# EAGLE design mapleCUx_large_4.1-018-not-produced (EAGLE 9.1.1)
MAPLE-CUx Large Version
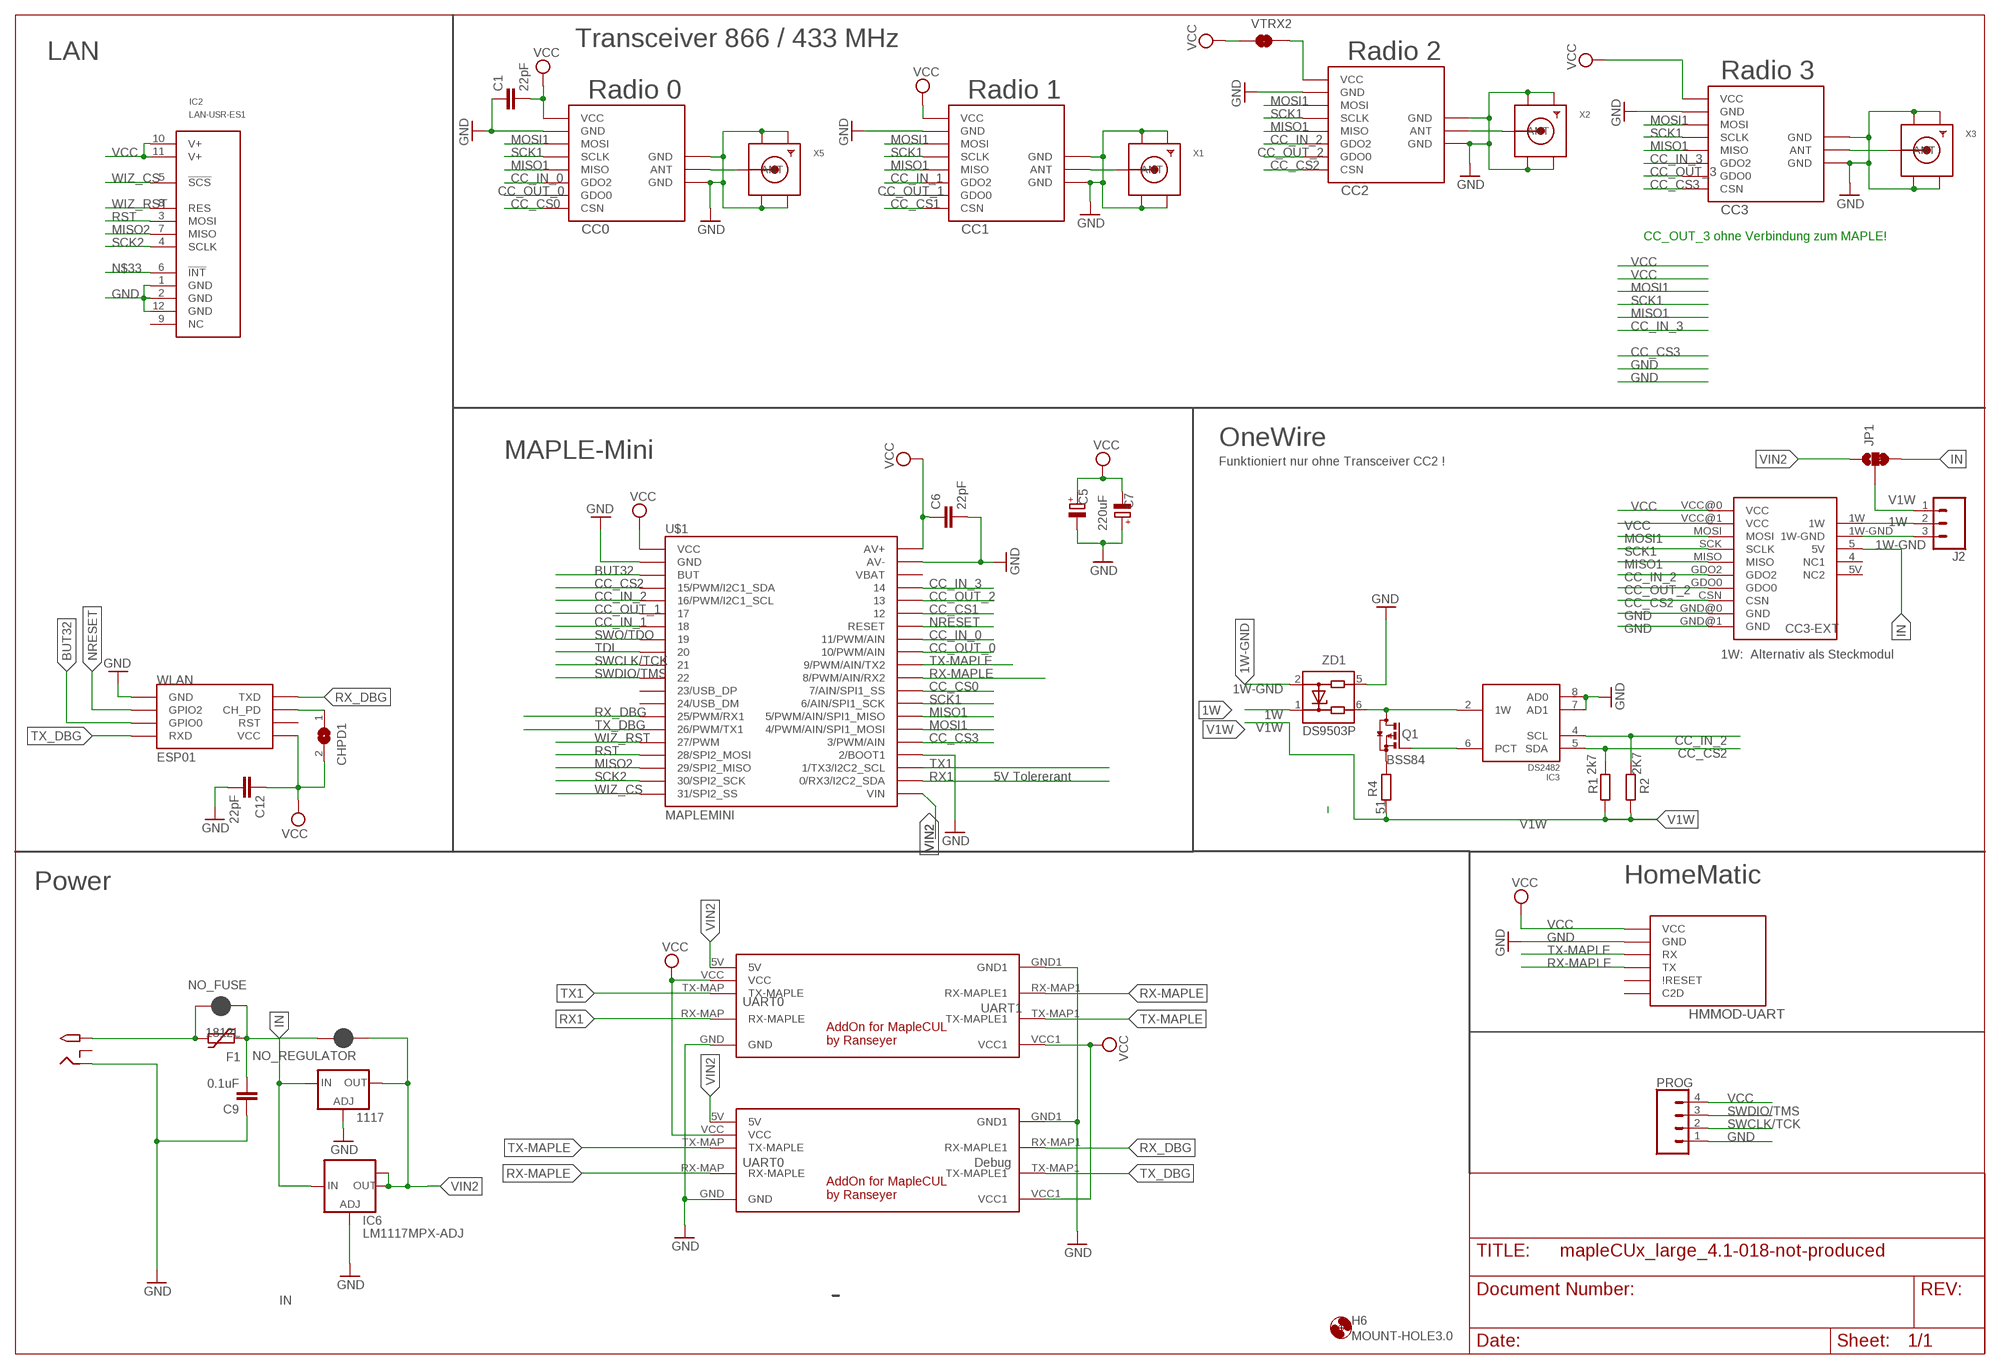
[diagram p0: schematic, sheet 1]

## Parts
1117  LD117ADT50TR  [DPACK]
C1  22pF  C-EUC0805  [C0805]
C5  220uF  CPOL-EUE5-8.5  [E5-8,5]
C6  22pF  C-EUC0805  [C0805]
C7  CPOL-EUSMCE  [SMC_E]
C9  0.1uF  C-EUC1206  [C1206]
C12  22pF  C-EUC0805  [C0805]
CC0  CC1101  CC1101_MODULE1SMD  [CC1101_MODULE1_SMD]
CC1  CC1101_MODULE1SMD  [CC1101_MODULE1_SMD]
CC2  CC1101_MODULE1SMD  [CC1101_MODULE1_SMD]
CC3  CC1101_MODULE1SMD  [CC1101_MODULE1_SMD]
CC3-EXT  ONEWIRE-MODULE  [ONEWIRE_CC1101_MODULE3_DIL]
CHPD1  SJ  [SJ]
F1  1812L  [1812L]
H6  MOUNT-HOLE3.0  [3,0]
HMMOD-UART  HM-MOD-UARTDIL  [HM-MOD-UART-DIL]
IC2  LAN-USR-ES1  [USR-ES1]
IC3  DS2482  DS2482-100S  [SO08]
IC6  LM1117MPX-ADJ  [SOT223]
J2  CONN_03LONGPADS  [1X03_LONGPADS]
JP1  JUMPER-SMT_3_1-NC_TRACE_SILK  [SMT-JUMPER_3_1-NC_TRACE_SILK]
NO_FUSE  JUMPER-SMT_2_NC_PASTE_NO-SILK  [SMT-JUMPER_2_NC_PASTE_NO-SILK]
NO_REGULATOR  JUMPER-SMT_2_NC_PASTE_NO-SILK  [SMT-JUMPER_2_NC_PASTE_NO-SILK]
PROG  CONN_04LOCK  [1X04_LOCK]
Q1  BSS84  [SOT23]
R1  2k7  R-EU_R0805  [R0805]
R2  2K7  R-EU_R0805  [R0805]
R4  51  R-EU_R0805  [R0805]
U$1  MAPLEMINI  [20-DIP]
U$2  2.1MMJACKTHM  [PJ-102A]
U$3  MAPLE-CUL-ADDON-V01  [MAPLE-CUL-V01]
U$4  MAPLE-CUL-ADDON-V01  [MAPLE-CUL-V01]
VTRX2  JUMPER-SMT_2_NC_TRACE_SILK  [SMT-JUMPER_2_NC_TRACE_SILK]
WLAN  ESP01  [ESP01]
X1  SMACONNECTOR_EDGE  [SMA_EDGELAUNCH]
X2  SMACONNECTOR_EDGE  [SMA_EDGELAUNCH]
X3  SMACONNECTOR_EDGE  [SMA_EDGELAUNCH]
X5  SMACONNECTOR_EDGE  [SMA_EDGELAUNCH]
ZD1  DS9503P  [TSOC6]

## Nets
1W: CC3-EXT.1W J2.2 ZD1.1
1W-GND: CC3-EXT.1W-GND J2.3 ZD1.2
ANT0: CC0.ANT X5.P(ANT)
ANT1: CC1.ANT X1.P(ANT)
ANT2: CC2.ANT X2.P(ANT)
ANT3: CC3.ANT X3.P(ANT)
BUT32: U$1.3(BUT) WLAN.GPIO0
CC_CS0: CC0.CSN U$1.29(7/AIN/SPI1_SS)
CC_CS1: CC1.CSN U$1.35
CC_CS2: CC2.CSN CC3-EXT.CSN IC3.5(SDA) R1.2 U$1.4(15/PWM/I2C1_SDA)
CC_CS3: CC3.CSN U$1.25(3/PWM/AIN)
CC_IN_0: CC0.GDO2 U$1.33(11/PWM/AIN)
CC_IN_1: CC1.GDO2 U$1.7
CC_IN_2: CC2.GDO2 CC3-EXT.GDO2 IC3.4(SCL) R2.2 U$1.5(16/PWM/I2C1_SCL)
CC_IN_3: CC3.GDO2 U$1.37
CC_OUT_0: CC0.GDO0 U$1.32(10/PWM/AIN)
CC_OUT_1: CC1.GDO0 U$1.6
CC_OUT_2: CC2.GDO0 CC3-EXT.GDO0 U$1.36
CC_OUT_3: CC3.GDO0
GND [Power]: 1117.1(ADJ) C1.1 C5.- C6.2 C7.+ C9.1 C12.2 CC0.GND@0(GND) CC0.GND@1(GND) CC0.GND@2(GND) CC1.GND@0(GND) CC1.GND@1(GND) CC1.GND@2(GND) CC2.GND@0(GND) CC2.GND@1(GND) CC2.GND@2(GND) CC3-EXT.GND@0(GND) CC3-EXT.GND@1(GND) CC3.GND@0(GND) CC3.GND@1(GND) CC3.GND@2(GND) HMMOD-UART.2(GND) IC2.1(GND) IC2.2(GND) IC2.12(GND) IC3.7(AD1) IC3.8(AD0) IC6.1(ADJ) PROG.1 U$1.2(GND) U$1.24(2/BOOT1) U$1.39(AV-) U$2.RING U$3.GND U$3.GND1 U$4.GND U$4.GND1 WLAN.GND X1.GND@1(GND4) X1.GND@2(GND3) X1.GND@3(GND2) X1.GND@4(GND1) X2.GND@1(GND4) X2.GND@2(GND3) X2.GND@3(GND2) X2.GND@4(GND1) X3.GND@1(GND4) X3.GND@2(GND3) X3.GND@3(GND2) X3.GND@4(GND1) X5.GND@1(GND4) X5.GND@2(GND3) X5.GND@3(GND2) X5.GND@4(GND1) ZD1.5
IN [Power]: 1117.3(IN) C9.2 CC3-EXT.5(5V) F1.P$1 IC6.3(IN) JP1.3 NO_FUSE.1 NO_REGULATOR.2
MISO1: CC0.MISO CC1.MISO CC2.MISO CC3-EXT.MISO CC3.MISO U$1.27(5/PWM/AIN/SPI1_MISO)
MISO2: IC2.7(MISO) U$1.18(29/SPI2_MISO)
MOSI1: CC0.MOSI CC1.MOSI CC2.MOSI CC3-EXT.MOSI CC3.MOSI U$1.26(4/PWM/AIN/SPI1_MOSI)
N$1 [Power]: CC2.VCC VTRX2.2
N$2: CHPD1.1 WLAN.CH_PD
N$33: IC2.6(!INT!)
N$47: IC3.6(PCT) Q1.1(G)
N$48: IC3.2(1W) Q1.3(D) ZD1.6
N$52: Q1.2(S) R4.1
NRESET: U$1.34(RESET) WLAN.GPIO2
RST: IC2.3(MOSI) U$1.17(28/SPI2_MOSI)
RX1: U$1.22(0/RX3/I2C2_SDA) U$3.RX-MAP(RX-MAPLE)
RX-MAPLE: HMMOD-UART.5(TX) U$1.30(8/PWM/AIN/RX2) U$3.RX-MAP1(RX-MAPLE1) U$4.RX-MAP(RX-MAPLE)
RX_DBG: U$1.14(25/PWM/RX1) U$4.RX-MAP1(RX-MAPLE1) WLAN.TX(TXD)
SCK1: CC0.SCLK CC1.SCLK CC2.SCLK CC3-EXT.SCK(SCLK) CC3.SCLK U$1.28(6/AIN/SPI1_SCK)
SCK2: IC2.4(SCLK) U$1.19(30/SPI2_SCK)
SWCLK/TCK: PROG.2 U$1.10
SWDIO/TMS: PROG.3 U$1.11
SWO/TDO: U$1.8
TDI: U$1.9
TX1: U$1.23(1/TX3/I2C2_SCL) U$3.TX-MAP(TX-MAPLE)
TX-MAPLE: HMMOD-UART.6(RX) U$1.31(9/PWM/AIN/TX2) U$3.TX-MAP1(TX-MAPLE1) U$4.TX-MAP(TX-MAPLE)
TX_DBG: U$1.15(26/PWM/TX1) U$4.TX-MAP1(TX-MAPLE1) WLAN.RX(RXD)
V1W [Power]: J2.1 JP1.2 R1.1 R2.1 R4.2
VCC [Power]: C1.2 C5.+ C6.1 C7.- C12.1 CC0.VCC CC1.VCC CC3-EXT.VCC@0(VCC) CC3-EXT.VCC@1(VCC) CC3.VCC CHPD1.2 HMMOD-UART.1(VCC) IC2.10(V+) IC2.11(V+) PROG.4 U$1.1(VCC) U$1.40(AV+) U$3.VCC U$3.VCC1 U$4.VCC U$4.VCC1 VTRX2.1 WLAN.VCC
VIN [Power]: F1.P$2 NO_FUSE.2 U$2.TIP
VIN2 [Power]: 1117.4(OUT) IC6.2(OUT) IC6.TAB(OUT1) JP1.1 NO_REGULATOR.1 U$1.21(VIN) U$3.5V U$4.5V
WIZ_CS: IC2.5(!SCS!) U$1.20(31/SPI2_SS)
WIZ_RST: IC2.8(RES) U$1.16(27/PWM)
Unconnected: CC3-EXT.4(NC1) CC3-EXT.5V(NC2) HMMOD-UART.3(C2D) HMMOD-UART.4(\!RESET) IC2.9(NC) U$1.12(23/USB_DP) U$1.13(24/USB_DM) U$1.38(VBAT) U$2.RING_SW WLAN.RST

## Notes on the sheet
- Transceiver 866 / 433 MHz
- LAN | Radio 2
- Radio 3
- Radio 0 | Radio 1
- CC_OUT_3 ohne Verbindung zum MAPLE!
- OneWire
- MAPLE-Mini
- Funktioniert nur ohne Transceiver CC2 !
- 1W:  Alternativ als Steckmodul
- 5V Tolererant
- Power | HomeMatic
- UART0
- UART1
- UART0 | Debug

## Power pins joined to a net without a drawn wire
GND: IC3.3(GND)
V1W: IC3.1(VDD)

## Library data of the parts
1117 = v-reg:LD117A?*: Low drop fixed and adjustable positive voltage regulators 1 A Source: http://www.st.com/stonline/products/literature/ds/7194/ld1117axx.pdf
C1 C6 C9 C12 = rcl:C-EU: CAPACITOR, European symbol
C5 = rcl:CPOL-EU: POLARIZED CAPACITOR, European symbol
C7 = rcl:CPOL-EU: POLARIZED CAPACITOR, European symbol; SPICEPREFIX: C
CC0 CC1-CC3 = wireless:CC1101_MODULE1: CC1101 wireless module for 433/868 MHz (sold from Aliexpress). DIL version for mounting with pin header (and SMD soldering) and SMD only variant available.
CC3-EXT = CC1101:ONEWIRE-MODULE
CHPD1 = jumper:SJ: SMD solder JUMPER
F1 = ptc-littlefuse:1812L
H6 = holes:MOUNT-HOLE: MOUNTING HOLE with drill center marker
HMMOD-UART = wireless:HM-MOD-UART: eQ3 HM-MOD-UART-AW-SH2 wireless module for 868 MHz. DIL version for mounting with pin header (antenna upwards) and SMD variant available (antenna downwards).
IC2 = Martin-Communication:LAN-USR-ES1
IC3 = 1wire:DS2482-100: I2C to 1-Wire Host Adapter/Line Driver This device is a onewire host and I2C interface in one chip. It provides the complete DC/AC requirements for onewire communication, including overdrive speed mode, but, unlike the DS2480B chip, no 12V EPROM programming. Notes: For overdrive speed and 5V EEPROM programming, an external active pullup circuit must be connected to the 1W, VDD and PCT pin. See the datasheet for details. The lower two I2C adress bits of the chip can be selected by external pins, so up to 4 chips may be connected to the same I2C bus. Author: Orginal device and description from Giovanni Varasano <giovanni.varasano@fastwebnet.it> Improved by Jan Kandziora <jjj@gmx.de>
IC6 = lm1117:LM1117MPX-ADJ
J2 = SparkFun-Connectors:CONN_03: Multi connection point. Often used as Generic Header-pin footprint for 0.1 inch spaced/style header connections On any of the 0.1 inch spaced packages, you can populate with these: Break Away Headers - Straight <https://www.sparkfun.com/products/116> (PRT-00116) Break Away Male Headers - Right Angle <https://www.sparkfun.com/products/553> (PRT-00553) Female Headers <https://www.sparkfun.com/products/115> (PRT-00115) Break Away Headers - Machine Pin <https://www.sparkfun.com/products/117> (PRT-00117) Break Away Female Headers - Swiss Machine Pin <https://www.sparkfun.com/products/743> (PRT-00743) Stackable Header - 3 Pin (Female, 0.1") <https://www.sparkfun.com/products/13875> (PRT-13875) For SCREWTERMINALS and SPRING TERMINALS visit here: Screw Terimnals on SparkFun.com <https://www.sparkfun.com/search/results?term=Screw+Terminals> (5mm/3.5mm/2.54mm spacing) This device is also useful as a general connection point to wire up your design to another part of your project. Our various solder wires solder well into these plated through hole pads. Hook-Up Wire - Assortment (Stranded, 22 AWG) <https://www.sparkfun.com/products/11375> (PRT-11375) Hook-Up Wire - Assortment (Solid Core, 22 AWG) <https://www.sparkfun.com/products/11367> (PRT-11367) View the entire wire category on our website here <https://www.sparkfun.com/categories/141> Special notes: Molex polarized connector foot print use with SKU : PRT-08232 with associated crimp pins and housings.
JP1 = SparkFun-Jumpers:JUMPER-SMT_3_1-NC_TRACE: Normally closed trace jumper (1 of 2 connections) This jumper has a trace between two pads so it's normally closed (NC). The other connection is normally open (NO). Use a razor knife to open the connection. For best results follow the IPC guidelines for cutting traces: Cutout at least 0.063 mm (0.005 in). Remove all loose material to clean up the cut area. Seal the cut with an approved epoxy. Reapply solder to reclose the connection, or to close the NO connection.
NO_FUSE NO_REGULATOR = SparkFun-Jumpers:JUMPER-SMT_2_NC_PASTE: Normally closed solder jumper This jumper has an aperture in the stencil to allow solder paste to bridge the split in the wire so it's normally closed (NC). Wick off the solder to open the connection. Reapply solder to reclose the connection.
PROG = SparkFun-Connectors:CONN_04: Multi connection point. Often used as Generic Header-pin footprint for 0.1 inch spaced/style header connections On any of the 0.1 inch spaced packages, you can populate with these: Break Away Headers - Straight <https://www.sparkfun.com/products/116> (PRT-00116) Break Away Male Headers - Right Angle <https://www.sparkfun.com/products/553> (PRT-00553) Female Headers <https://www.sparkfun.com/products/115> (PRT-00115) Break Away Headers - Machine Pin <https://www.sparkfun.com/products/117> (PRT-00117) Break Away Female Headers - Swiss Machine Pin <https://www.sparkfun.com/products/743> (PRT-00743) For SCREWTERMINALS and SPRING TERMINALS visit here: Screw Terimnals on SparkFun.com <https://www.sparkfun.com/search/results?term=Screw+Terminals> (5mm/3.5mm/2.54mm spacing) This device is also useful as a general connection point to wire up your design to another part of your project. Our various solder wires solder well into these plated through hole pads. Hook-Up Wire - Assortment (Stranded, 22 AWG) <https://www.sparkfun.com/products/11375> (PRT-11375) Hook-Up Wire - Assortment (Solid Core, 22 AWG) <https://www.sparkfun.com/products/11367> (PRT-11367) View the entire wire category on our website here <https://www.sparkfun.com/categories/141> Special notes: Molex polarized connector foot print use with SKU : PRT-08231 with associated crimp pins and housings. 1MM SMD Version SKU: PRT-10208; PROD_ID: CONN-09696
Q1 = transistor-small-signal:BSS84: P-CHANNEL MOS FET
R1 R2 R4 = rcl:R-EU_: RESISTOR, European symbol
U$1 = maplemini-small:MAPLEMINI
U$2 = adafruit:2.1MMJACK: 2.1mm x 5.5mm THM DC jack with internal switch. Digikey part #PJ-102A, 4UCON part #05537 2.1mm x 5.5mm SMT DC jack with internal switch. Digikey part #PJ-002A-SMT, 4UCON part #03267 By microbuilder.eu & adafruit.com
U$3 U$4 = Martin-Communication-V4:MAPLE-CUL-ADDON-V01: AddOn for MAPLE-CUL V4.x
VTRX2 = SparkFun-Jumpers:JUMPER-SMT_2_NC_TRACE: Normally closed trace jumper This jumper has a trace between two pads so it's normally closed (NC). Use a razor knife to open the connection. For best results follow the IPC guidelines for cutting traces: Cutout at least 0.063 mm (0.005 in). Remove all loose material to clean up the cut area. Seal the cut with an approved epoxy. Reapply solder to reclose the connection.
WLAN = esp8266modules:ESP01: ESP8266 Wifi module 01
X1-X3 X5 = adafruit:SMACONNECTOR: SMA Connector 90° DIP SMA Connector, 50 Ohm (4UConnector: 07259)
ZD1 = 1wire:DS9503: ESD Protection Diode with Resistors This ESD protection diode is designed especially for onewire host interfaces. Unlike the DS9502, it has two additional 5Ohm resitors in the 1W and GND line. Pin 5 and 6 have to be connected to the host side, pin 1 und 2 to the network side. The 1W line is through pin 1 and 6, the GND line is through pin 2 and 5. Author: Jan Kandziora <jjj@gmx.de>

## Net classes
0 default: width 0.305 mm
1 Power: width 0.61 mm

## Board
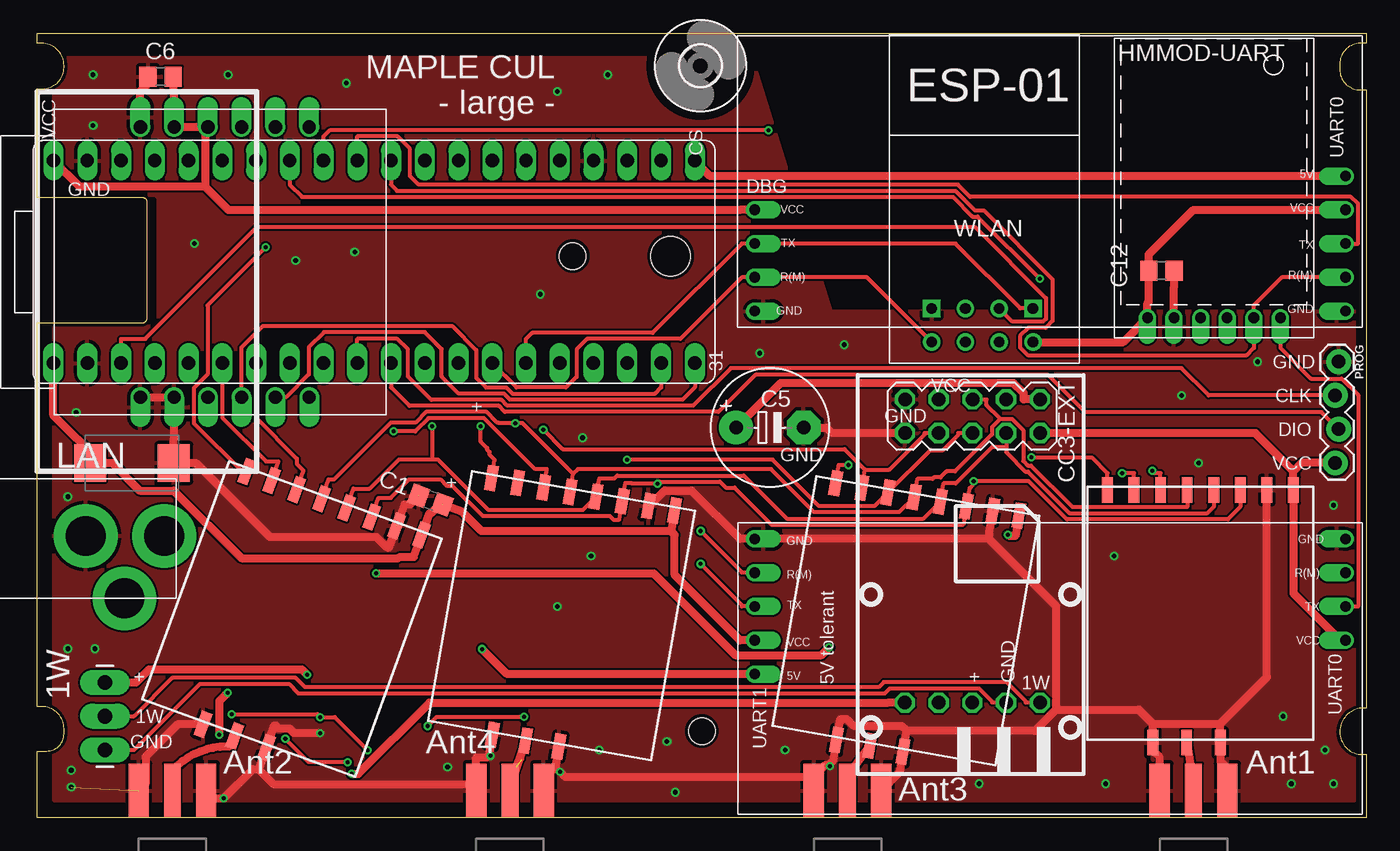
[diagram p1: board, top side]
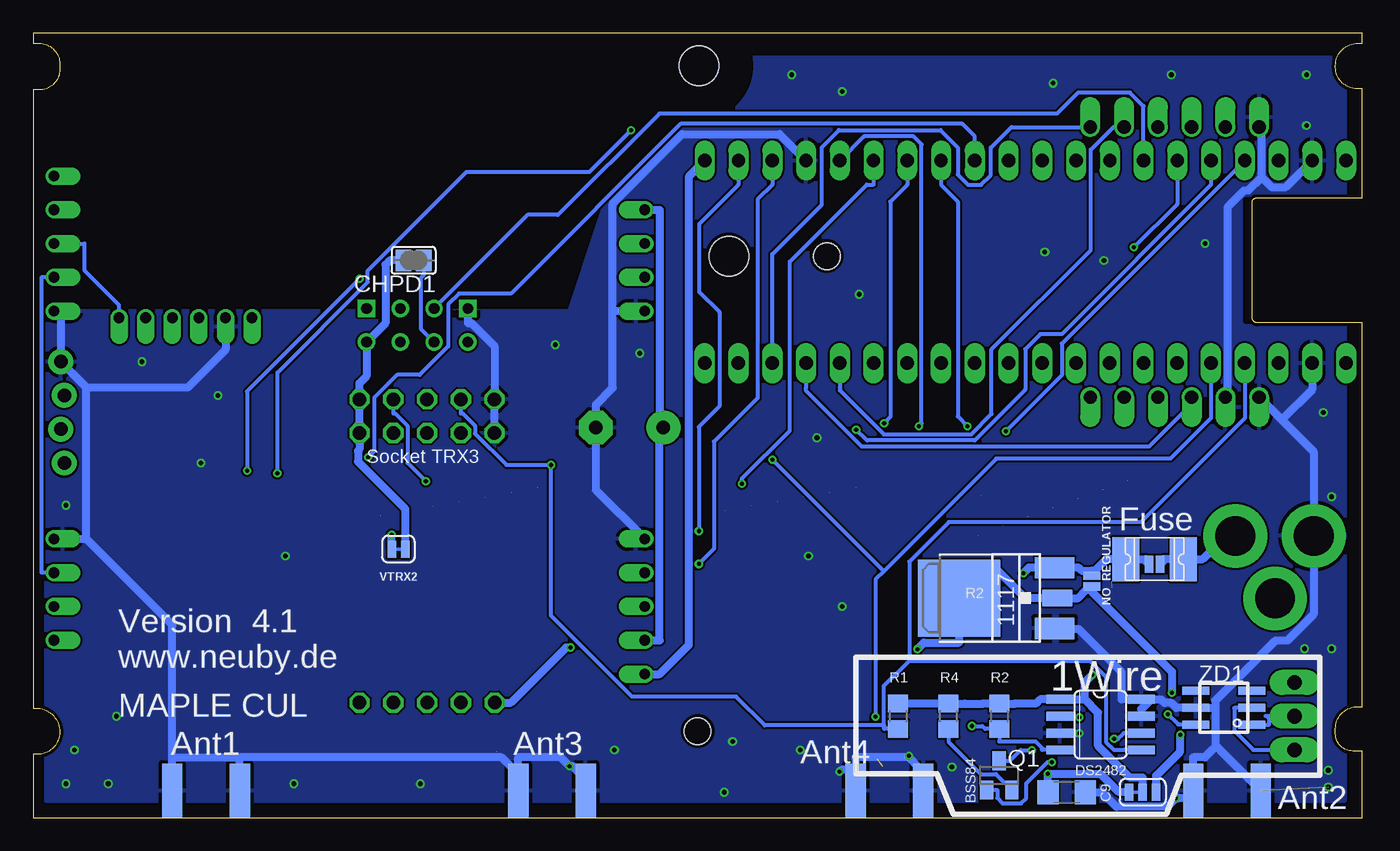
[diagram p2: board, bottom side, seen from below]

Size 100 x 59 mm. Coordinates in mm from the lower left corner, seen from the top.
Outline: 0,0 0,5 0.71,5 arc90 2,6.29 2,6.67 arc90 0.32,8.35 0,8.35 0,37.21 7.89,37.21 arc90 8.26,37.58 8.26,46.32 arc90 7.97,46.61 0,46.61 0,54.83 0.39,54.83 arc90 2,56.44 2,56.57 arc90 0.33,58.24 0,58.24 0,59 100,59 100,58.24 99.54,58.24 arc90 98,56.7 98,56.41 arc90 99.41,54.75 100,54.75 100,8.24 99.8,8.24 arc90 98,6.44 arc90 99.69,4.75 100,4.75 100,0 0,0
Copper layers (1*16): Top 0.035mm / dielectric 1.5mm / Bottom 0.035mm
Design rules "SeeedStudio_2layer_DRU_no_angle_20140221": minimum track width 6mil, minimum drill 12mil, track to track 6mil, track to pad 6mil, pad to pad 6mil, via to via 6mil, smd to smd 0mil, copper to edge 10mil, drill to drill 10mil, minimum pad ring 10mil, minimum via ring 6mil, stop-mask expansion 2mil, vias tented up to drill 100mil, thermal gap 10mil
Holes 2 mm at 50,6.5 40.28,42.23
Holes 3 mm at 47.65,42.23
tRestrict: area 0,37.3 to 8.8,46.5; area 56,49.3 to 99.1,58.4
bRestrict: area 0,37.3 to 8.8,46.5; area 56.2,49.3 to 98.8,58.4

### Footprints (pad centres in the part's own frame; a part is rotated, then mirrored left to right if it is on the bottom)
DPACK = smd 1.6 x 3: 1 -2.28,-4.8; 3 2.28,-4.8 | smd 5.8 x 6.2: 4 0,2.38
C0805 = smd 1.3 x 1.5: 1 -0.95,0; 2 0.95,0
E5-8,5 = drill 1.016 pad 2.54: + -2.54,0 | drill 1.016 pad 2.54 octagon: - 2.54,0
SMC_E = smd 2.4 x 2.8: + -3.15,0; - 3.15,0
C1206 = smd 1.6 x 1.8: 1 -1.4,0; 2 1.4,0
CC1101_MODULE1_SMD = smd 1.93 x 0.813: ANT 19,5.96; CSN 0,0; GDO0 0,2; GDO2 0,4; GND@0 0,12; GND@1 19,8.5; GND@2 19,3.42; MISO 0,6; MOSI 0,10; SCLK 0,8; VCC 0,14
ONEWIRE_CC1101_MODULE3_DIL = drill 1.016 octagon: 1W 24.638,13.716; 1W-GND 24.638,11.176; 4 24.638,6.096; 5 24.638,3.556; 5V 24.638,8.636; CSN 1.81,6.1; GDO0 4.35,6.1; GDO2 4.35,8.64; GND@0 1.81,3.56; GND@1 4.35,3.56; MISO 1.81,8.64; MOSI 1.81,11.18; SCK 4.35,11.18; VCC@0 1.81,13.72; VCC@1 4.35,13.72
SJ = smd 1.168 x 1.6: 1 -0.762,0; 2 0.762,0
1812L = smd 2.03 x 3.3: P$1 -2.16,0; P$2 2.16,0
3,0 = hole 3: 0,0
HM-MOD-UART-DIL = drill 0.8 offset: 1 0,12; 2 0,10; 3 0,8; 4 0,6; 5 0,4; 6 0,2
USR-ES1 = drill 1 pad 1.35 offset: 1 -10.16,5.715; 2 -10.16,3.175; 3 -10.16,0.635; 4 -10.16,-1.905; 5 -10.16,-4.445; 6 -10.16,-6.985; 7 10.16,-6.985; 8 10.16,-4.445; 9 10.16,-1.905; 10 10.16,0.635; 11 10.16,3.175; 12 10.16,5.715
SO08 = smd 0.66 x 2.032: 1 -1.905,-3.073; 2 -0.635,-3.073; 3 0.635,-3.073; 4 1.905,-3.073; 5 1.905,3.073; 6 0.635,3.073; 7 -0.635,3.073; 8 -1.905,3.073
SOT223 = smd 1.219 x 2.235: 1 -2.311,-3.099; 2 0,-3.099; 3 2.311,-3.099 | smd 3.6 x 2.2: TAB 0,3.099
1X03_LONGPADS = drill 1.118 pad 1.88 long: 1 0,0; 2 2.54,0; 3 5.08,0
SMT-JUMPER_3_1-NC_TRACE_SILK = smd 0.635 x 1.27: 1 -1.016,0; 2 0,0; 3 1.016,0
SMT-JUMPER_2_NC_PASTE_NO-SILK = smd 0.635 x 1.27: 1 -0.406,0; 2 0.406,0
1X04_LOCK = drill 1.016 pad 1.88: 1 0,0.127; 2 2.54,-0.127; 3 5.08,0.127; 4 7.62,-0.127
SOT23 = smd 1 x 1.4: 1 -0.95,-1.1; 2 0.95,-1.1; 3 0,1.1
R0805 = smd 1.3 x 1.5: 1 -0.95,0; 2 0.95,0
20-DIP = drill 1.016 pad 1.27 long: 1 -24.13,-7.62; 2 -21.59,-7.62; 3 -19.05,-7.62; 4 -16.51,-7.62; 5 -13.97,-7.62; 6 -11.43,-7.62; 7 -8.89,-7.62; 8 -6.35,-7.62; 9 -3.81,-7.62; 10 -1.27,-7.62; 11 1.27,-7.62; 12 3.81,-7.62; 13 6.35,-7.62; 14 8.89,-7.62; 15 11.43,-7.62; 16 13.97,-7.62; 17 16.51,-7.62; 18 19.05,-7.62; 19 21.59,-7.62; 20 24.13,-7.62 | drill 1 pad 1.27 long: 21 24.13,7.62; 22 21.59,7.62; 23 19.05,7.62; 24 16.51,7.62; 25 13.97,7.62; 26 11.43,7.62; 27 8.89,7.62; 28 6.35,7.62; 29 3.81,7.62; 30 1.27,7.62; 31 -1.27,7.62; 32 -3.81,7.62; 33 -6.35,7.62; 34 -8.89,7.62; 35 -11.43,7.62; 36 -13.97,7.62; 37 -16.51,7.62; 38 -19.05,7.62; 39 -21.59,7.62; 40 -24.13,7.62
PJ-102A = drill 3 pad 4.8: RING 0.1,-3.39; RING_SW -4.6,-6.29; TIP 0.1,-9.29
MAPLE-CUL-V01 = drill 0.8 offset: 5V 1.27,2.54; GND 1.27,12.7; GND1 45.72,12.7; RX-MAP 1.27,10.16; RX-MAP1 45.72,10.16; TX-MAP 1.27,7.62; TX-MAP1 45.72,7.62; VCC 1.27,5.08; VCC1 45.72,5.08
SMT-JUMPER_2_NC_TRACE_SILK = smd 0.635 x 1.27: 1 -0.508,0; 2 0.508,0
ESP01 = drill 0.8: CH_PD -1.285,-8.178; GPIO0 1.255,-5.638; GPIO2 -1.285,-5.638; RST 1.255,-8.178; TX -3.825,-8.178; VCC 3.795,-8.178 | drill 0.8 square: GND -3.825,-5.638; RX 3.795,-5.638
SMA_EDGELAUNCH = smd 4.064 x 1.524: GND@1 2.032,-2.54; GND@2 2.032,2.54 | smd 4.064 x 1.524 bottom: GND@3 2.032,2.54; GND@4 2.032,-2.54 | smd 4.064 x 1.27: P 2.032,0
TSOC6 = smd 0.61 x 2.032: 1 -1.27,-2.108; 2 0,-2.108; 3 1.27,-2.108; 4 1.27,2.108; 5 0,2.108; 6 -1.27,2.108

### Placement (x,y rotation side)
1117  27.94,16.51 90 bottom
C1  29.59,23.88 340 top
C5  55.12,29.34 0 top
C6  9.27,55.74 180 top
C7  7.11,26.67 180 top
C9  22.23,1.91 180 bottom
C12  84.58,41.15 0 top
CC0  80.52,24.64 270 top
CC1  15.75,26.04 250 top
CC2  60.07,25.15 260 top
CC3  34.16,25.53 260 top
CC3-EXT  61.72,33.27 270 top
CHPD1  71.37,41.91 180 bottom
F1  15.62,19.43 0 bottom
H6  49.89,56.55 0 top
HMMOD-UART  95.54,37.59 90 top
IC2  13.46,41.78 90 top
IC3  19.68,6.99 270 bottom
IC6  26.04,16.51 90 bottom
J2  5.08,10.16 270 top
JP1  16.51,1.91 180 bottom
NO_FUSE  15.62,19.05 0 bottom
NO_REGULATOR  20.32,17.78 90 bottom
PROG  97.79,34.29 270 top
Q1  27.3,3.17 0 bottom
R1  34.92,7.62 270 bottom
R2  27.3,7.62 270 bottom
R4  31.11,7.62 90 bottom
U$1  25.34,41.8 0 top
U$2  0.25,21.08 90 top
U$3  52.7,8.26 0 top
U$4  99.69,50.8 180 top
VTRX2  72.52,20.19 180 bottom
WLAN  71.12,43.94 0 top
X1  10.16,0 90 top
X2  60.96,0 90 top
X3  35.56,0 90 top
X5  87,0 90 top
ZD1  10.41,8.26 90 bottom

### Tracks (layer width: path | path; a pad name or v marks a point on that pad's centre or on a via)
1W
  Top 0.305: CC3-EXT.1W 74.37,8.64 74.37,8.75 72.94,10.18 63.69,10.18 63.32,9.81 20.14,9.81 19.44,10.51 10.15,10.51 7.26,7.62 J2.2
  Bottom 0.305: ZD1.1 6.99,6.99 6.99,7.44 7.16,7.62 7.26,7.62 | J2.2 7.26,7.62 | 7.26,7.62
1W-GND
  Top 0.305: CC3-EXT.1W-GND 71.83,8.64 71.83,8.75 70.86,9.72 64.14,9.72 63.77,9.35 19.63,9.35 18.93,10.05 12.23,10.05 7.26,5.08 J2.3
  Bottom 0.305: ZD1.2 9.63,8.26 9.63,6.51 8.19,5.08 J2.3
ANT0
  Top 0.61: CC0.ANT 86.87,3.3 arc-8 X5.P
ANT1
  Top 0.305: X1.P 10.16,3.56
  Top 0.61: CC1.ANT 14.85,5.96 arc-90 14.22,5.33 arc47 10.16,3.56
ANT2
  Top 0.61: CC2.ANT 61.47,3.81 arc41 X2.P
ANT3  (1 unrouted)
  Top 0.305: 36.45,4.37 36.49,4.41 | 36.49,4.41
  Top 0.61: CC3.ANT 36.07,3.81 arc5 X3.P
BUT32
  Top 0.305: WLAN.GPIO0 73.38,37.3 75.68,37.3 75.89,37.51 75.89,39.07 70.54,44.42 16.53,44.42 8.12,36.01 6.29,36.01 U$1.3
CC_CS0  (via drill 0.3 pad 0.61)
  Top 0.305: CC0.CSN 80.52,25.91 79.33,27.09 v74.8,27.09
  Bottom 0.305: U$1.29 29.15,51.23 30.09,52.17 51.3,52.17 64.06,39.41 67.95,39.41 68.77,38.6 68.77,35.44 70.92,33.29 72.63,33.29 74.33,31.59 74.33,27.56 v74.8,27.09
CC_CS1  (via drill 0.3 pad 0.61)
  Top 0.305: v17.16,42.89 12.8,38.53 12.8,33.34 11.77,32.31 11.77,29.66 15.39,26.04 CC1.CSN
  Bottom 0.305: U$1.35 13.91,46.15 v17.16,42.89
CC_CS2  (via drill 0.3 pad 0.61)
  Top 0.305: v61.04,26.52 60.31,26.52 CC2.CSN
  Bottom 0.305: R1.2 35.98,6.67 35.98,6.91 36,6.93 | 36,6.93 44.94,6.93 47.11,9.09 54.94,9.09 61.04,15.19 v61.04,26.52 64.39,26.52 66.75,28.89 66.75,29.46 67.69,30.4 67.82,30.4 CC3-EXT.CSN | 34.07,11.81 36,9.88 36,6.93 | U$1.4 8.83,30.02 16.63,22.22 31.11,22.22 34.07,19.25 34.07,11.81 | 34.07,11.81 20.49,11.81 19.27,10.59 19.27,5.67 18.68,5.08 17.93,5.08 IC3.5
CC_CS3  (via drill 0.3 pad 0.61)
  Top 0.305: 34.41,26.9 | 34.41,26.9 34.03,27.27 34.03,27.48 33.85,27.66 33.85,27.78 33.36,28.27 v33.36,29.44 | CC3.CSN 34.41,26.9
  Bottom 0.305: v33.36,29.44 33.16,29.64 33.16,50.64 33.77,51.24 37.48,51.24 U$1.25
CC_IN_0  (via drill 0.3 pad 0.61)
  Top 0.305: v83.9,26.09 84.08,25.91 84.52,25.91 CC0.GDO2 | v75.43,40.53 70.75,45.21 70.38,45.21 68.89,46.69 19.9,46.69 18.99,47.61 U$1.33
  Bottom 0.305: v75.43,40.53 83.9,32.06 v83.9,26.09
CC_IN_1  (1 unrouted)
  Top 0.305: CC1.GDO2 20.03,26.1 | U$1.7 16.45,30.06 19.51,27 19.51,26.63 20.03,26.1 | 20.03,26.1
CC_IN_2  (via drill 0.3 pad 0.61)  (1 unrouted)
  Top 0.305: v44.37,26.93 55.32,26.93 58.82,23.43 62.98,23.43 CC2.GDO2 67.21,27.65 68.13,27.65 69.3,28.81 69.3,28.92 CC3-EXT.GDO2 | v29.37,6.88 30.05,7.57 v36.61,7.57
  Bottom 0.305: 35.99,18.54 v44.37,26.93 | U$1.5 11.37,30.05 14.42,27 27.53,27 35.99,18.54 | 35.99,18.54 36.61,17.92 v36.61,7.57 | v29.37,6.88 28.57,6.88 28.36,6.67 R2.2 27.3,5.71 24.55,5.71 24.08,5.24 24.08,5.08 IC3.4
CC_IN_3  (via drill 0.3 pad 0.61)  (1 unrouted)
  Top 0.305: v26.81,29.05 28.44,29.05 29.44,30.05 33.61,30.05 37.45,26.21 38.34,26.21 CC3.GDO2
  Bottom 0.305: U$1.37 22.59,35.65 22.59,33.27 v26.81,29.05
CC_OUT_0  (via drill 0.3 pad 0.61)
  Top 0.305: v55.01,51.69 21.98,51.69 21.53,51.23 U$1.32 | v81.62,25.91 82.52,25.91 CC0.GDO0
  Bottom 0.305: v81.62,25.91 81.62,33.47 74.82,40.28 74.82,41.13 67.39,48.56 58.14,48.56 v55.01,51.69
CC_OUT_1  (1 unrouted)
  Top 0.305: CC1.GDO0 18.15,26.79 17.2,26.79 13.91,30.08 U$1.6
CC_OUT_2  (via drill 0.3 pad 0.61)  (1 unrouted)
  Top 0.305: 62.28,26.17 64.11,26.17 66.75,28.81 66.75,28.92 CC3-EXT.GDO0 | 62.28,26.17 | v38.07,29.18 39.53,27.72 60.73,27.72 62.28,26.17 | CC2.GDO0 62.28,26.17
  Bottom 0.305: U$1.36 11.37,47.61 22.6,36.37 24.21,36.37 25.34,35.25 25.34,32.19 29.15,28.37 37.26,28.37 v38.07,29.18
GND  (via drill 0.3 pad 0.61, 0.35)  (11 unrouted)
  Top 0.61: 89.02,7.06 92.52,10.56 CC0.GND@0 | 83.94,7.06 89.02,7.06 | 76.66,8.11 82.89,8.11 83.94,7.06 | 89.02,7.06 CC0.GND@1 89.02,4.21 89.53,3.7 X5.GND@4 | 76.66,8.11 75.06,6.51 65.42,6.51 | 71.61,20.95 76.66,15.91 76.66,8.11 | 83.94,7.06 CC0.GND@2 83.94,5.04 84.45,4.52 X5.GND@3 | 71.61,21.51 | 71.61,21.51 71.61,20.95 | 71.61,20.95 U$3.GND 53.88,20.95 52.86,20.95 49.23,24.58 47.2,24.58 46.06,23.44 CC3.GND@0 | IC2.12 7.75,54.66 8.32,55.24 C6.2 | v21.29,6.35 19.31,6.35 18.97,6.68 18.17,6.68 17.94,6.91 17.83,6.91 CC1.GND@1 16.64,3.64 | 16.64,3.64 16.23,3.64 v14.03,1.44 13.29,1.44 X1.GND@4 | 33.02,2.47 17.82,2.47 16.64,3.64 | 33.02,2.47 33.02,4.52 33.81,4.52 33.96,4.67 | X3.GND@3 33.02,2.47 | 65.42,6.51 | 65.42,6.51 65.05,6.88 61.45,6.88 60.94,7.39 60.41,7.39 CC2.GND@2 59.87,4.29 | 65.42,6.51 CC2.GND@1 64.87,3.41 | 59.55,3.97 v59.65,3.87 | 58.42,3.09 59.3,3.97 59.55,3.97 | 59.55,3.97 59.87,4.29 | 59.87,4.29 | C12.2 85.53,39.94 85.54,39.94 HMMOD-UART.2 | CC2.GND@0 71.61,21.51 | 58.42,3.09 39.67,3.09 v39.32,3.44 v39.31,3.44 38.96,3.79 | 38.96,3.79 | 38.96,3.79 38.26,3.09 38.1,3.09 X3.GND@4 | X2.GND@3 58.42,3.09 | CC3.GND@1 38.96,3.79 | 10.26,31.62 IC2.2 | IC2.1 10.26,31.62 | 10.26,31.62 10.26,28.53 C7.+ 11.92,26.67 17.48,21.11 25.5,21.11 26.32,20.3 26.43,20.3 CC1.GND@0 27.62,23.56 28.06,23.56 C1.1 | 33.96,4.67 | v34.11,4.63 34,4.63 33.96,4.67 | CC3.GND@2 33.96,4.67 | C5.- 59.38,29.34 59.8,28.92 CC3-EXT.GND@1 | X2.GND@1 64.87,3.4 64.87,3.41 | 64.87,3.41 | CC1.GND@2 10.57,7.01 8.13,4.57 8.13,2.54 X1.GND@3
  Bottom 0.61: HMMOD-UART.2 85.54,35.17 88.33,32.38 96.01,32.38 | 96.01,32.38 PROG.1 97.92,37.59 U$4.GND | 96.01,20.95 96.01,32.38 | 89.53,4.52 89.53,14.48 96.01,20.95 | 11.05,5.3 11.18,5.17 11.83,4.52 12.7,4.52 X1.GND@4 13.29,1.44 v14.03,1.44 14.65,0.81 18.47,0.81 19.57,1.91 C9.1 | 11.05,8.26 11.05,5.3 | 11.05,5.3 10.89,5.3 X1.GND@3 | 11.05,8.26 11.05,8.79 6.53,13.32 5.63,13.32 3.64,15.3 U$2.RING 3.64,27.52 6.03,29.91 | 16.24,8.52 IC3.8 18.09,8.89 18.09,10.92 21.36,14.2 IC6.1 23.11,14.2 1117.1 | IC3.3 v21.29,6.35 | 56.39,38.1 56.39,46.18 51.17,51.4 43.83,51.4 U$1.24 | 56.39,38.1 56.39,32.33 57.66,31.06 C5.- 57.66,24.64 U$3.GND | U$4.GND1 56.39,38.1 | CC3-EXT.GND@1 CC3-EXT.GND@0 65.28,35.46 67.02,37.19 67.3,37.19 WLAN.GND | 63.5,3.28 64.75,4.52 84.45,4.52 | 63.5,3.28 63.5,4.52 60.31,4.52 v59.65,3.87 59.4,3.87 58.42,2.89 X2.GND@3 | X2.GND@1 63.5,3.28 | 38.1,3.59 39.17,3.59 v39.32,3.44 | 38.1,3.59 38.1,4.52 34.11,4.52 | X3.GND@4 38.1,3.59 | 34.11,4.52 33.28,3.69 33.02,3.69 X3.GND@3 | v34.11,4.63 34.11,4.52 | 16.24,8.52 16.61,8.15 IC3.7 | 16.24,8.52 15.88,8.89 15.14,8.89 14.87,8.62 14.36,8.62 13.99,8.26 ZD1.5 11.05,8.26 | 7.56,48.18 7.56,51.75 IC2.12 | IC2.2 10.1,31.81 10.1,45.95 8.87,47.18 8.56,47.18 7.56,48.18 | 7.56,48.18 6.8,47.42 5.74,47.42 U$1.39 | 6.03,29.91 IC2.1 | 6.03,29.91 3.75,32.2 U$1.2 | U$3.GND1 96.01,20.95 | 89.53,4.52 89.53,3.28 X5.GND@4 | X5.GND@3 84.45,4.52 | 89.53,4.52 84.45,4.52
  other vias: 2.54,2.29 2.54,3.56 2.29,12.7 4.32,12.7 2.29,24.13 2.92,30.48 11.81,43.18 23.88,42.55 19.43,41.91 4.19,55.88 4.19,52.07 14.35,55.88 23.24,55.24 39.12,54.61 42.93,55.88 37.85,39.37 41.02,28.57 41.66,19.68 39.12,15.88 60.71,35.56 54.36,34.92 91.82,34.29 86.11,31.75 87.38,26.67 81.03,19.68 93.73,7.62 97.54,2.54 96.9,5.08 94.36,2.54 80.39,2.54 70.87,2.54 56.26,5.08 47.37,5.71 42.29,5.08 30.86,3.81 48.01,1.91 97.54,23.5
  pour Bottom: 1.27,1.27 1.27,57.15 53.34,57.15 59.69,38.1 99.06,38.1 99.06,1.27
  pour Top: 1.27,1.27 1.27,57.15 53.74,57.15 59.69,38.1 99.06,38.1 99.06,1.27
IN  (via drill 0.3 pad 0.61)
  Top 0.61: v25.48,18.37 46.36,18.37 52.51,12.22 59.01,12.22 v59.58,12.79 | v23.65,3.29 24.14,3.29 29.49,8.64 64.06,8.64 CC3-EXT.5
  Bottom 0.61: v25.48,18.37 25.1,18.75 25.1,18.79 1117.3 23.11,18.82 IC6.3 21.36,18.82 21.11,18.57 20.32,18.57 | CC3-EXT.5 64.06,8.64 59.91,12.79 v59.58,12.79 | v23.65,3.29 23.62,3.26 | JP1.3 18.3,1.91 19.66,3.26 23.62,3.26 | C9.2 23.62,3.26 | 20.32,18.57 20.11,18.57 19.25,19.43 F1.P$1 17.05,19.43 16.31,19.43 16.31,19.33 NO_FUSE.1 | NO_REGULATOR.2 20.32,18.57
MISO1  (via drill 0.3 pad 0.61)  (3 unrouted)
  Top 0.305: 72.46,29.99 73.34,29.99 74.19,29.14 74.19,26.84 74.55,26.48 74.78,26.48 77.89,23.37 86.52,23.37 CC0.MISO | 40.31,25.86 40.66,26.21 55.2,26.21 58.45,22.97 64.84,22.97 CC2.MISO 66.22,25.48 67.35,25.48 67.46,25.59 67.95,25.59 68.41,26.05 69.06,26.05 71.83,28.82 71.83,29.37 72.46,29.99 | 40.31,25.86 36.5,29.67 v35.96,29.67 34.73,29.67 34.69,29.71 34.59,29.71 33.8,30.51 29.25,30.51 28.45,29.71 26.59,29.71 22.3,25.42 21.91,25.42 CC1.MISO | 72.46,29.99 71.43,31.02 71.43,31.46 CC3-EXT.MISO | 40.31,25.86 | CC3.MISO 40.31,25.86
  Bottom 0.305: v35.96,29.67 35.5,30.14 35.5,46.34 34.23,47.61 U$1.27
MISO2
  Bottom 0.305: U$1.18 44.39,42.38 40.65,46.11 40.65,50.42 39.37,51.7 31.72,51.7 30.42,50.4 30.42,48.36 29.65,47.59 28.67,47.59 27.93,48.33 27.93,50.39 26.38,51.94 IC2.7
MOSI1  (via drill 0.3 pad 0.61)  (3 unrouted)
  Top 0.305: CC1.MOSI 25.67,24.05 26.58,24.05 27.96,25.43 30.32,25.43 30.78,24.98 31.22,24.98 33.51,22.69 43.07,22.69 43.34,22.42 43.77,22.42 CC3.MOSI 44.25,25.16 44.69,25.16 44.73,25.11 v46.65,25.11 46.81,25.27 51.35,25.27 51.81,24.81 52.46,24.81 55.24,22.04 69.68,22.04 CC2.MOSI 70.16,24.78 | CC0.MOSI 90.52,23.37 89.58,22.43 77.48,22.43 74.62,25.29 v70.45,25.29 70.45,25.07 70.16,24.78 | 70.16,24.78
  Bottom 0.305: CC3-EXT.MOSI 72.9,30.4 72.77,30.4 71.83,29.46 71.83,26.68 v70.45,25.29 | v46.65,25.11 46.65,25.5 43.06,29.1 43.06,41.82 37.27,47.61 36.77,47.61 U$1.26
N$1  (via drill 0.3 pad 0.61)  (1 unrouted)
  Top 0.61: v73.03,21.29 73.15,21.16 73.58,21.16 CC2.VCC
  Bottom 0.61: VTRX2.2 v73.03,21.29
N$2
  Bottom 0.305: CHPD1.1 70.61,40.8 70.8,40.62 70.8,36.73 WLAN.CH_PD
N$47  (via drill 0.3 pad 0.61)
  Top 0.305: v23.33,4.16 20.42,4.16 v18.66,5.92
  Bottom 0.305: Q1.1 27.45,2.08 27.45,1.47 27.05,1.07 25.66,1.07 25.27,1.46 25.27,2.57 23.68,4.16 v23.33,4.16 | IC3.6 17.93,6.35 18.36,5.92 v18.66,5.92
N$48  (via drill 0.3 pad 0.61)
  Top 0.305: v24.84,5.07 22.37,7.55 v21.28,7.55 21.05,7.78 v14.62,7.78
  Bottom 0.305: v24.84,5.07 25.7,5.07 26.5,4.28 Q1.3 | IC3.2 21.44,7.62 21.37,7.55 v21.28,7.55 | ZD1.6 13.84,6.99 13.84,7 v14.62,7.78
N$52
  Bottom 0.305: R4.1 31.11,5.71 28.67,3.27 27.55,3.27 Q1.2
NRESET
  Bottom 0.305: U$1.34 16.45,53.51 17.47,54.53 21.39,54.53 22.96,52.96 52.88,52.96 60.51,45.33 62.81,45.33 WLAN.GPIO2
RST
  Bottom 0.305: IC2.3 12.83,31.11 16.04,27.9 37.65,27.9 41.85,32.1 41.85,32.35 U$1.17
RX1  (via drill 0.3 pad 0.61)
  Top 0.305: v49.91,21.56 53.02,18.45 53.02,18.41 U$3.RX-MAP
  Bottom 0.305: v49.91,21.56 49.91,29.39 48.37,30.94 48.37,38.03 49.89,39.55 49.89,44.65 46.93,47.61 U$1.22
RX-MAPLE
  Top 0.305: U$4.RX-MAP 93.62,40.64 91.54,38.55 HMMOD-UART.5 91.54,35.33 91,34.79 74.52,34.79 73.94,35.37 73.94,36.23 74.56,36.84 75.88,36.84 76.39,37.36 76.39,40.48 71.21,45.67 70.56,45.67 69.08,47.15 27.06,47.15 26.61,47.61 U$1.30
  Bottom 0.305: U$3.RX-MAP1 99.38,18.41 99.38,40.64 U$4.RX-MAP
RX_DBG
  Top 0.305: WLAN.TX 62.42,40.64 U$4.RX-MAP1 53.02,40.64 48.38,36.01 41.37,36.01 40.58,35.21 40.58,33.16 39.77,32.35 36.05,32.35 U$1.14
SCK1  (via drill 0.3 pad 0.61)  (3 unrouted)
  Top 0.305: 72.9,27.86 72.9,27.48 74.36,26.02 74.54,26.02 77.67,22.89 88.04,22.89 88.52,23.37 CC0.SCLK | 29.69,26.95 30.12,26.95 33.93,23.14 41.05,23.14 CC3.SCLK 42.28,25.51 43.42,25.51 43.63,25.73 53.16,25.73 56.39,22.49 66.69,22.49 CC2.SCLK 68.19,25.13 69.11,25.13 71.83,27.86 72.9,27.86 | 29.69,26.95 27.2,26.95 24.98,24.74 23.79,24.74 CC1.SCLK | v29.69,29.44 29.69,26.95 | CC3-EXT.SCK 72.9,27.86
  Bottom 0.305: v29.69,29.44 30.42,30.17 30.42,46.34 31.69,47.61 U$1.28
SCK2
  Top 0.305: IC2.4 15.37,35.37 16.97,36.98 31.2,36.98 33.02,35.17 33.02,33.08 33.75,32.35 35.28,32.35 35.74,31.89 46.47,31.89 46.93,32.35 U$1.19
SWCLK/TCK
  Top 0.305: PROG.2 88.15,31.75 86.08,33.81 52.18,33.81 49.34,30.98 35.36,30.98 34.92,31.42 29.63,31.42 27.88,33.17 27.88,35.21 27.08,36.01 24.07,36.01 U$1.10
SWDIO/TMS
  Top 0.305: PROG.3 96.62,30.5 78.84,30.5 76.05,33.3 54.02,33.3 51.24,30.52 35.17,30.52 34.73,30.96 27.99,30.96 26.61,32.35 U$1.11
TX1  (via drill 0.3 pad 0.61)
  Top 0.305: v49.91,19.08 53.02,15.97 53.02,15.88 U$3.TX-MAP
  Bottom 0.305: v49.91,19.08 48.78,20.21 48.78,28.27 45.49,31.56 45.49,46.5 44.39,47.61 U$1.23
TX-MAPLE
  Top 0.305: U$3.TX-MAP1 99.38,15.88 99.38,31.79 98.16,33.02 95.84,33.02 93.54,35.33 HMMOD-UART.6 | U$1.31 24.07,51.23 27.1,51.23 28.04,50.29 28.04,48.25 28.69,47.61 69.27,47.61 70.19,46.69 98.85,46.69 99.38,46.16 99.38,43.18 U$4.TX-MAP
  Bottom 0.305: HMMOD-UART.6 93.54,38.55 96.16,41.17 96.16,43.18 U$4.TX-MAP
TX_DBG
  Top 0.305: U$1.15 36.77,36.01 37.22,36.47 46.3,36.47 53.02,43.18 U$4.TX-MAP1 69.08,43.18 73.96,38.3 WLAN.RX
V1W  (via drill 0.3 pad 0.61)
  Top 0.61: v20.29,10.74 19.9,11.13 8.39,11.13 7.42,10.16 J2.1
  Bottom 0.61: 20.87,8.89 19.88,7.9 19.88,5.42 17.46,3 16.51,3 JP1.2 | 20.87,8.89 20.87,10.17 v20.29,10.74 | 20.87,8.89 21.29,8.89 IC3.1 24.23,8.89 24.55,8.57 26.1,8.57 R2.1 28.51,8.57 29.91,8.57 R4.2 R1.1
VCC  (3 unrouted)
  Top 0.61: WLAN.VCC 81.71,35.76 HMMOD-UART.1 83.54,38.7 83.63,38.8 C12.1 83.63,42.35 87,45.72 U$4.VCC | 31.94,23.02 C1.2 30.28,23.55 29.61,22.88 29.5,22.88 CC1.VCC 28.31,19.61 27.27,19.61 27.17,19.51 15.36,19.51 10.27,24.6 7.69,24.6 5.62,26.67 4.79,26.67 | 47.68,21.55 33.41,21.55 31.94,23.02 | 31.94,23.02 | 47.68,21.55 47.95,21.27 47.95,18.25 52.86,13.34 U$3.VCC | 47.68,21.55 | CC3-EXT.VCC@0 74.22,31.46 74.22,31.92 73.46,32.69 55.93,32.69 C5.+ | CC3.VCC 47.68,21.55 | 12.64,47.45 14.37,45.72 52.86,45.72 53.42,45.72 U$4.VCC1 | 12.64,51.94 12.64,47.45 | 12.64,47.45 3.18,47.45 U$1.40 | 4.79,26.67 1.21,30.25 U$1.1 | C7.- 4.79,26.67 | U$3.VCC1 98.04,13.34 94.52,16.86 CC0.VCC 94.52,24.66 94.52,26.06 | C6.1 10.22,54.53 10.29,54.46 IC2.11 12.64,51.94 | IC2.10 12.64,51.94 | 94.52,26.06 91.65,28.92 CC3-EXT.VCC@1 | PROG.4 95.13,26.67 94.52,26.06
  Bottom 0.61: VTRX2.1 72.01,23.21 75.56,26.77 75.56,27.59 75.44,27.7 CC3-EXT.VCC@1 CC3-EXT.VCC@0 75.44,32.68 74.92,33.21 WLAN.VCC 73.49,37.19 73.49,41.6 73.18,41.91 CHPD1.2 | U$4.VCC1 52.86,45.72 52.86,29.62 C5.+ 52.86,29.05 52.86,13.34 U$3.VCC
VIN
  Bottom 0.61: NO_FUSE.2 14.93,19.33 14.93,19.43 F1.P$2 11.99,19.43 10.24,21.18 U$2.TIP
VIN2  (via drill 0.3 pad 0.61)
  Top 0.61: U$4.5V 50.63,48.26 U$1.21 | U$3.5V 35.34,10.79 v33.46,12.68 | v14.31,9.38 13.68,8.75 v13.68,6.22
  Bottom 0.61: U$3.5V 52.86,10.79 50.69,12.97 50.69,48.2 U$1.21 | v33.46,12.68 32.98,13.15 30.32,13.15 1117.4 IC6.TAB 29.13,18.77 27.58,18.77 25.32,16.51 23.72,16.51 IC6.2 21.36,16.51 20.73,17.14 20.32,17.14 | 20.32,17.14 20.32,16.99 14.31,10.98 v14.31,9.38 | NO_REGULATOR.1 20.32,17.14 | JP1.1 15.49,3.15 13.68,4.97 v13.68,6.22
WIZ_CS
  Top 0.305: IC2.5 18.7,31.62 20.42,33.34 20.42,35.36 21.57,36.51 29.14,36.51 30.42,35.23 30.42,33.17 31.71,31.88 35.1,31.88 35.55,31.44 48.55,31.44 49.47,32.35 U$1.20
WIZ_RST
  Bottom 0.305: IC2.8 18.72,51.94 20.42,50.24 20.42,42.67 27.88,35.21 27.88,30.37 29.41,28.83 36,28.83 39.31,32.14 39.31,32.35 U$1.16

### Text on the board
tNames: MAPLE CUL / - large - | CS | VCC | UART0 | GND | DBG | 31 | GND | VCC | CLK | GND | + | DIO | LAN | GND | VCC | + | GND | 1W | + | 5V tolerant | + | 1W | 1W | UART0 | GND | Ant4 | UART1 | Ant2 | Ant1 | Ant3
bNames: Socket TRX3 | Fuse | R2 | 1Wire | Version 4.1 / www.neuby.de | R2 | R4 | R1 | MAPLE CUL | Ant3 | Ant1 | BSS84 | Ant4 | C9 | DS2482 | Ant2